# Altium project Explorer STM32F4_V2.2.PrjPcb
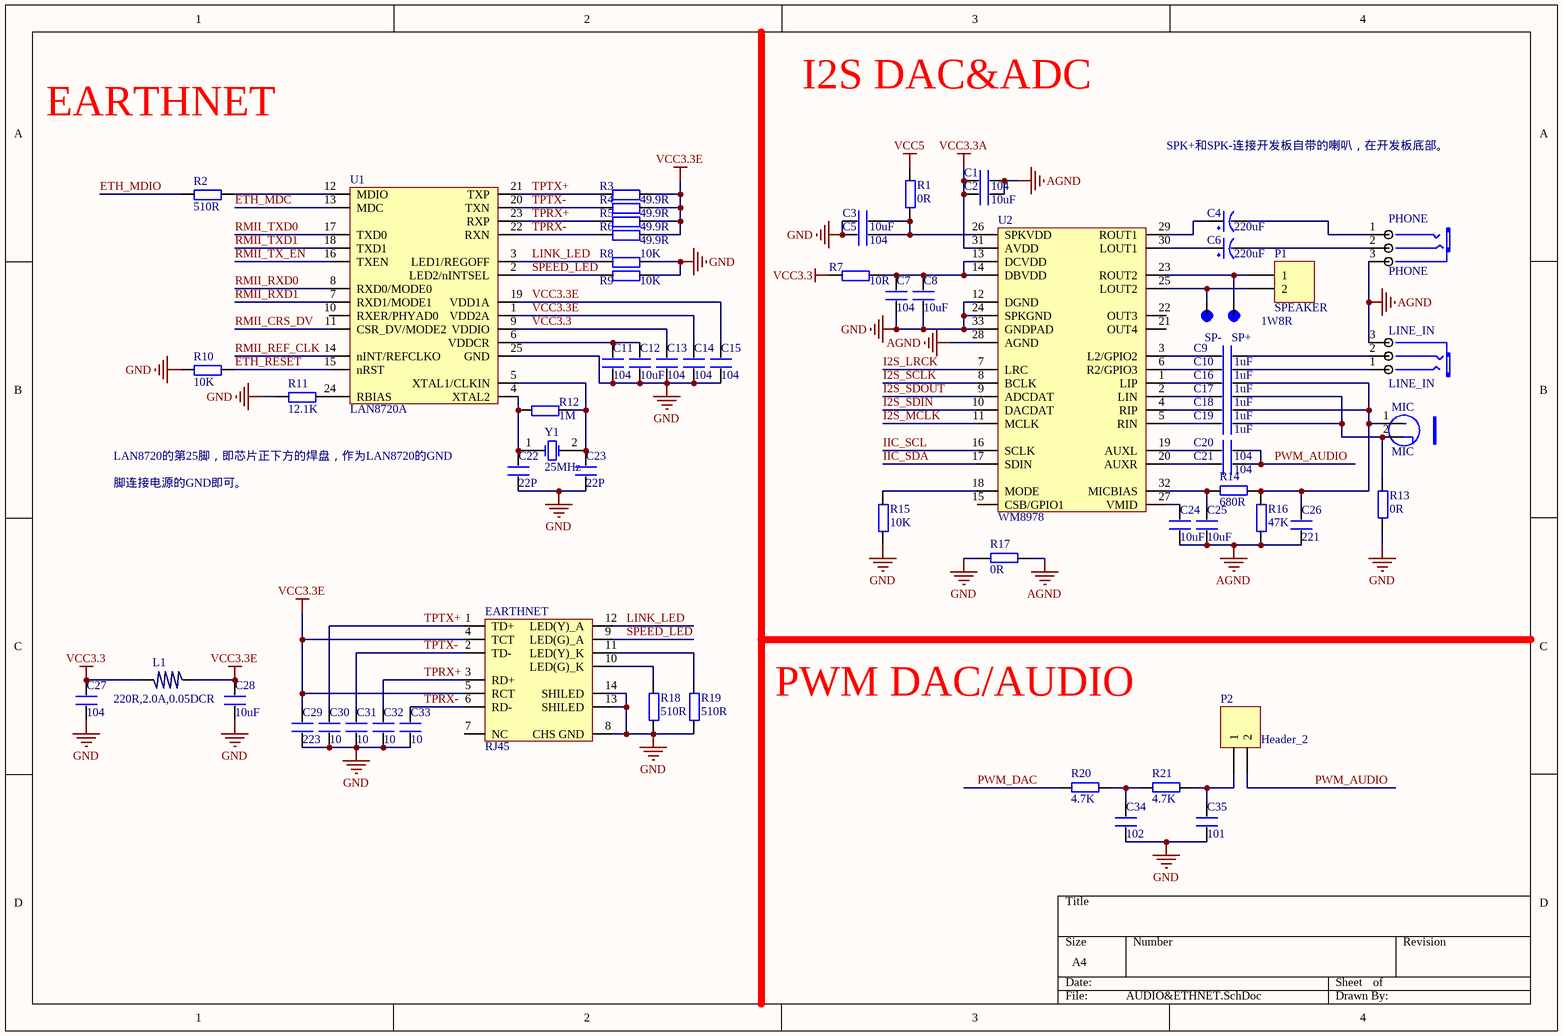
[diagram p0: AUDIO&ETHNET.SchDoc]
4 sheets, 259 parts. Net scope: global (net labels, ports and power ports of the same name join across sheets).
Board file: STM32F4_V2.2.PcbDoc
Sheets:
  AUDIO&ETHNET.SchDoc
  CORE.SchDoc
  DEVICES.SchDoc
  POWER&USB_USART.SchDoc

## Sheet AUDIO&ETHNET.SchDoc
size A4

### Parts
C1  104  [R0603]
C2  10uF  [1206]
C3  10uF  [1206]
C4  220uF  [CC6.56.5]
C5  104  [R0603]
C6  220uF  [CC6.56.5]
C7  104  [R0603]
C8  10uF  [1206]
C9  1uF  [R0603]
C10  1uF  [R0603]
C11  104  [R0603]
C12  10uF  [1206]
C13  104  [R0603]
C14  104  [R0603]
C15  104  [R0603]
C16  1uF  [R0603]
C17  1uF  [R0603]
C18  1uF  [R0603]
C19  1uF  [R0603]
C20  104  [R0603]
C21  104  [R0603]
C22  22P  [R0603]
C23  22P  [R0603]
C24  10uF  [1206]
C25  10uF  [1206]
C26  221  [R0603]
C27  104  [R0603]
C28  10uF  [1206]
C29  223  [R0603]
C30  10  [R0603]
C31  10  [R0603]
C32  10  [R0603]
C33  10  [R0603]
C34  102  [R0603]
C35  101  [R0603]
EARTHNET  RJ45  [HR911105A]
L1  220R,2.0A,0.05DCR  [R0603]
LINE_IN  LINE_IN  [PHONE_ST]
MIC  MIC  [MIC6027]
P1  SPEAKER  [HDR1X2]
P2  Header_2  [HDR1X2]
PHONE  PHONE  [PHONE_ST]
R1  0R  [R0603]
R2  510R  [R0603]
R3  49.9R  [R0603]
R4  49.9R  [R0603]
R5  49.9R  [R0603]
R6  49.9R  [R0603]
R7  10R  [R0603]
R8  10K  [R0603]
R9  10K  [R0603]
R10  10K  [R0603]
R11  12.1K  [R0603]
R12  1M  [R0603]
R13  0R  [R0603]
R14  680R  [R0603]
R15  10K  [R0603]
R16  47K  [R0603]
R17  0R  [R0603]
R18  510R  [R0603]
R19  510R  [R0603]
R20  4.7K  [R0603]
R21  4.7K  [R0603]
SP+  TEST_POINT  [TEST_POINT]  (value not drawn)
SP-  TEST_POINT  [TEST_POINT]  (value not drawn)
U1  LAN8720A  [QFN24_NEW]
U2  WM8978  [qfn32]
Y1  25MHz  [XTAL_US]

### Nets
AGND: C1.1 C2.1 C24.2 C25.2 C26.2 LINE_IN.3(COM) PHONE.3(COM) R16.1 R17.1 U2.28(AGND)
GND: C3.2 C5.2 C7.2 C8.2 C11.1 C12.1 C13.1 C14.1 C15.1 C22.1 C23.1 C27.1 C28.1 C29.1 C30.1 C31.1 C32.1 C33.1 C34.1 C35.1 EARTHNET.8(CHS_GND) EARTHNET.13(SHILED) EARTHNET.14(SHILED) R8.2 R9.2 R10.1 R11.1 R13.1 R15.1 R17.2 R18.1 R19.1 U1.25(GND) U2.12(DGND) U2.24(SPKGND) U2.33(GNDPAD)
VCC3.3: C13.2 C27.2 L1.2 R7.1 U1.9(VDDIO)
VCC3.3A: C1.2 C2.2 U2.31(AVDD)
VCC3.3E: C14.2 C15.2 C28.2 C29.2 EARTHNET.4(TCT) EARTHNET.5(RCT) L1.1 R3.2 R4.2 R5.2 R6.2 U1.1(VDD2A) U1.19(VDD1A)
VCC5: R1.2
ETH_MDC: U1.13(MDC)
ETH_MDIO: R2.1
ETH_RESET: R10.2 U1.15(nRST)
I2S_LRCK: U2.7(LRC)
I2S_MCLK: U2.11(MCLK)  [project net DCMI_D0]
I2S_SCLK: U2.8(BCLK)
I2S_SDIN: U2.10(DACDAT)
I2S_SDOUT: U2.9(ADCDAT)
IIC_SCL: U2.16(SCLK)
IIC_SDA: U2.17(SDIN)
LINK_LED: EARTHNET.12(LED(Y)_A) R8.1 U1.3(LED1/REGOFF)
PWM_AUDIO: C20.2 C21.2 P2.2
PWM_DAC: R20.2  [project net PA3]
RMII_CRS_DV: U1.11(CSR_DV/MODE2)  [project net PA7]
RMII_REF_CLK: U1.14(nINT/REFCLKO)  [project net PA1]
RMII_RXD0: U1.8(RXD0/MODE0)  [project net PC4]
RMII_RXD1: U1.7(RXD1/MODE1)  [project net PC5]
RMII_TX_EN: U1.16(TXEN)  [project net PG11]
RMII_TXD0: U1.17(TXD0)  [project net PG13]
RMII_TXD1: U1.18(TXD1)  [project net PG14]
SPEED_LED: EARTHNET.9(LED(G)_A) R9.1 U1.2(LED2/nINTSEL)
TPRX+: C32.2 EARTHNET.3(RD+) R5.1 U1.23(RXP)
TPRX-: C33.2 EARTHNET.6(RD-) R6.1 U1.22(RXN)
TPTX+: C30.2 EARTHNET.1(TD+) R3.1 U1.21(TXP)
TPTX-: C31.2 EARTHNET.2(TD-) R4.1 U1.20(TXN)
NetC3_1: C3.1 C5.1 R1.1 U2.26(SPKVDD)
NetC4_1: C4.1(VCC) U2.29(ROUT1)
NetC4_2: C4.2(GND) PHONE.1(CHL)
NetC6_1: C6.1(VCC) U2.30(LOUT1)
NetC6_2: C6.2(GND) PHONE.2(CHR)
NetC7_1: C7.1 C8.1 R7.2 U2.13(DCVDD) U2.14(DBVDD)
NetC9_1: C9.1 U2.3(L2/GPIO2)
NetC9_2: C9.2 LINE_IN.2(CHR)
NetC10_1: C10.1 U2.6(R2/GPIO3)
NetC10_2: C10.2 LINE_IN.1(CHL)
NetC11_2: C11.2 C12.2 U1.6(VDDCR)
NetC16_1: C16.1 U2.1(LIP)
NetC16_2: C16.2 C18.2 C26.1 MIC.1(VCC) R14.1 R16.2
NetC17_1: C17.1 U2.2(LIN)
NetC17_2: C17.2 C19.2 MIC.2(GND) R13.2
NetC18_1: C18.1 U2.4(RIP)
NetC19_1: C19.1 U2.5(RIN)
NetC20_1: C20.1 U2.19(AUXL)
NetC21_1: C21.1 U2.20(AUXR)
NetC22_2: C22.2 R12.1 U1.4(XTAL2) Y1.1(OSC1)
NetC23_2: C23.2 R12.2 U1.5(XTAL1/CLKIN) Y1.2(OSC2)
NetC24_1: C24.1 U2.27(VMID)
NetC25_1: C25.1 R14.2 U2.32(MICBIAS)
NetC34_2: C34.2 R20.1 R21.2
NetC35_2: C35.2 P2.1 R21.1
NetEARTHNET_10: EARTHNET.10(LED(G)_K) R18.2
NetEARTHNET_11: EARTHNET.11(LED(Y)_K) R19.2
NetP1_1: P1.1 SP+.1 U2.23(ROUT2)
NetP1_2: P1.2 SP-.1 U2.25(LOUT2)
NetR2_2: R2.2 U1.12(MDIO)
NetR11_2: R11.2 U1.24(RBIAS)
NetR15_2: R15.2 U2.18(MODE)

Not connected (* = marked no-connect by the designer): EARTHNET 7(NC); U1 10(RXER/PHYAD0); U2 15(CSB/GPIO1) 21(OUT4) 22(OUT3)

### Notes on the sheet
- I2S DAC&ADC
- EARTHNET
- SPK+和SPK-连接开发板自带的喇叭，在开发板底部。
- 1W8R
- LAN8720的第25脚，即芯片正下方的焊盘，作为LAN8720的GND
- 脚连接电源的GND即可。
- PWM DAC/AUDIO

### Library data of the parts
C1-C3 C5 C7-C35 = C
C4 C6 = CAP
EARTHNET = HR911105
L1 = L
LINE_IN PHONE = PHONE_M
P1 P2 = Header 2: Header, 2-Pin; LatestRevisionDate: 17-Jul-2002; LatestRevisionNote: Re-released for DXP Platform.; Publisher: Altium Limited
R1-R21 = R
U1 = LAN8720: ETH PHY
U2 = WM8978: 24bit ADC&DAC
Y1 = XTAL: Crystal Oscillator; Published: 8-Jun-2000; LatestRevisionDate: 17-Jul-2002; LatestRevisionNote: Re-released for DXP Platform.; Publisher: Altium Limited

## Sheet CORE.SchDoc
size A3
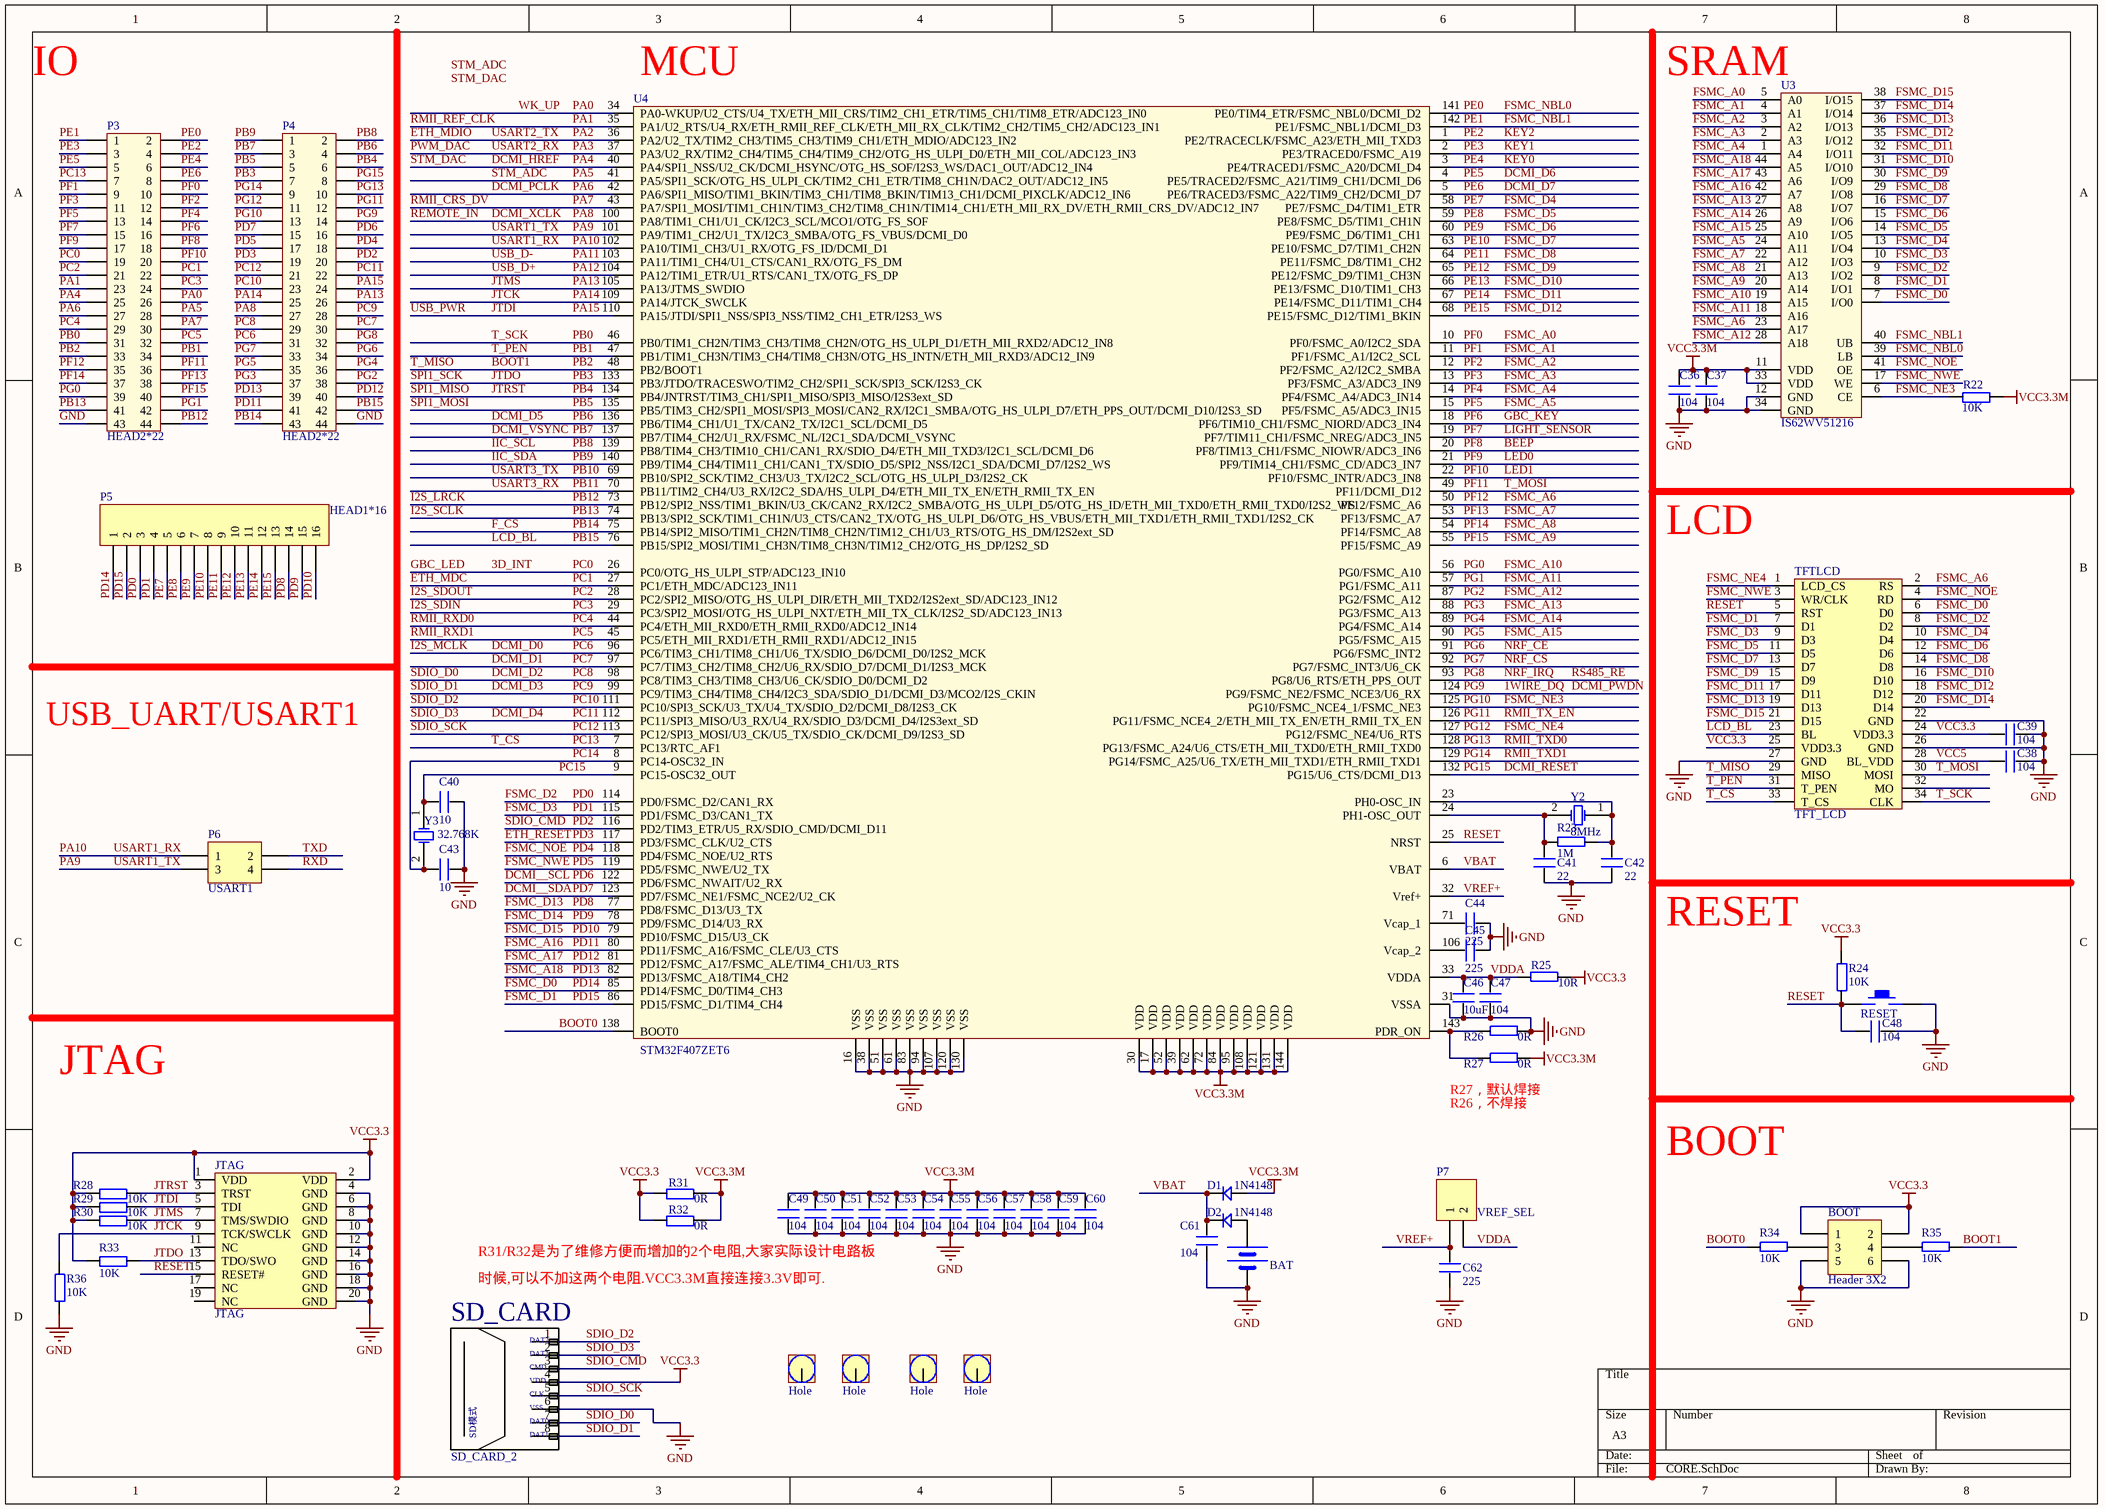
[diagram p1: CORE.SchDoc]

### Parts
BAT  BATT  [BATM]  (value not drawn)
BOOT  Header 3X2  [HDR2X3]
C36  104  [R0603]
C37  104  [R0603]
C38  104  [R0603]
C39  104  [R0603]
C40  10  [R0603]
C41  22  [R0603]
C42  22  [R0603]
C43  10  [R0603]
C44  225  [R0603]
C45  225  [R0603]
C46  10uF  [1206]
C47  104  [R0603]
C48  104  [R0603]
C49  104  [R0603]
C50  104  [R0603]
C51  104  [R0603]
C52  104  [R0603]
C53  104  [R0603]
C54  104  [R0603]
C55  104  [R0603]
C56  104  [R0603]
C57  104  [R0603]
C58  104  [R0603]
C59  104  [R0603]
C60  104  [R0603]
C61  104  [R0603]
C62  225  [R0603]
D1  1N4148  [DIODE_SOP]
D2  1N4148  [DIODE_SOP]
H1  Hole  [Hole_4.3Y]
H2  Hole  [Hole_4.3Y]
H3  Hole  [Hole_4.3Y]
H4  Hole  [Hole_4.3Y]
JTAG  JTAG  [JTAG_20]
P3  HEAD2*22  [HEAD2*22]
P4  HEAD2*22  [HEAD2*22]
P5  HEAD1*16  [HDR1X16]
P6  USART1  [HDR2X2]
P7  VREF_SEL  [HDR1X2]
R22  10K  [R0603]
R23  1M  [R0603]
R24  10K  [R0603]
R25  10R  [R0603]
R26  0R  [R0603]
R27  0R  [R0603]
R28  10K  [R0603]
R29  10K  [R0603]
R30  10K  [R0603]
R31  0R  [R0603]
R32  0R  [R0603]
R33  10K  [R0603]
R34  10K  [R0603]
R35  10K  [R0603]
R36  10K  [R0603]
RESET  KEY_M  [KEY_M]  (value not drawn)
SD_CARD_2  存储器接口  [TF_CARD_2]  (value not drawn)
TFTLCD  TFT_LCD  [db2*17-4.3]
U3  IS62WV51216  [TSOP44]
U4  STM32F407ZET6  [LQFP144]
Y2  8MHz  [XTAL_US]
Y3  32.768K  [XTAL32]

### Nets
GND: BAT.2(GND) BOOT.5 BOOT.6 C36.2 C37.2 C38.2 C39.2 C40.1 C41.2 C42.2 C43.1 C44.2 C45.2 C46.1 C47.1 C48.1 C49.1 C50.1 C51.1 C52.1 C53.1 C54.1 C55.1 C56.1 C57.1 C58.1 C59.1 C60.1 C61.2 C62.2 JTAG.4(GND) JTAG.6(GND) JTAG.8(GND) JTAG.10(GND) JTAG.12(GND) JTAG.14(GND) JTAG.16(GND) JTAG.18(GND) JTAG.20(GND) P3.43 P4.21 P4.44 R26.1 R36.1 RESET.2 SD_CARD_2.5(CLK) SD_CARD_2.6(VSS) TFTLCD.22(GND) TFTLCD.26(GND) TFTLCD.27(GND) U3.12(GND) U3.34(GND) U4.16(VSS) U4.31(VSSA) U4.38(VSS) U4.51(VSS) U4.61(VSS) U4.83(VSS) U4.94(VSS) U4.107(VSS) U4.113(PC12/SPI3_MOSI/U3_CK/U5_TX/SDIO_CK/DCMI_D9/I2S3_SD) U4.120(VSS) U4.130(VSS)  [also labelled PC12, SDIO_SCK]
VCC3.3: BOOT.1 BOOT.2 C39.1 JTAG.1(VDD) JTAG.2(VDD) R24.2 R25.1 R28.1 R29.1 R30.1 R31.1 R32.1 R33.1 SD_CARD_2.4(VDD) TFTLCD.24(VDD3.3) TFTLCD.25(VDD3.3)
VCC3.3M: C36.1 C37.1 C49.2 C50.2 C51.2 C52.2 C53.2 C54.2 C55.2 C56.2 C57.2 C58.2 C59.2 C60.2 D1.1 R22.2 R27.1 R31.2 R32.2 U3.11(VDD) U3.33(VDD) U4.17(VDD) U4.30(VDD) U4.39(VDD) U4.52(VDD) U4.62(VDD) U4.72(VDD) U4.84(VDD) U4.95(VDD) U4.108(VDD) U4.121(VDD) U4.131(VDD) U4.144(VDD)
VCC5: C38.1 TFTLCD.28(BL_VDD)
1WIRE_DQ: P4.14 U4.124(PG9/FSMC_NE2/FSMC_NCE3/U6_RX)  [also labelled DCMI_PWDN, PG9]
3D_INT: P3.19 U4.26(PC0/OTG_HS_ULPI_STP/ADC123_IN10)  [also labelled GBC_LED, PC0]
BEEP: P3.18 U4.20(PF8/TIM13_CH1/FSMC_NIOWR/ADC3_IN6)  [also labelled PF8]
BOOT0: R34.2 U4.138(BOOT0)
BOOT1: P3.33 R35.1 TFTLCD.29(MISO) U4.48(PB2/BOOT1)  [also labelled PB2, T_MISO]
DCMI__SCL: P4.16 U4.122(PD6/FSMC_NWAIT/U2_RX)  [also labelled PD6]
DCMI__SDA: P4.15 U4.123(PD7/FSMC_NE1/FSMC_NCE2/U2_CK)  [also labelled PD7]
DCMI_D0: P4.31 U4.96(PC6/TIM3_CH1/TIM8_CH1/U6_TX/SDIO_D6/DCMI_D0/I2S2_MCK)  [also labelled I2S_MCLK, PC6]
DCMI_D1: P4.30 U4.97(PC7/TIM3_CH2/TIM8_CH2/U6_RX/SDIO_D7/DCMI_D1/I2S3_MCK)  [also labelled PC7]
DCMI_D2: P4.29 SD_CARD_2.7(DAT0/DO) U4.98(PC8/TIM3_CH3/TIM8_CH3/U6_CK/SDIO_D0/DCMI_D2)  [also labelled PC8, SDIO_D0]
DCMI_D3: P4.28 SD_CARD_2.8(DAT1/X) U4.99(PC9/TIM3_CH4/TIM8_CH4/I2C3_SDA/SDIO_D1/DCMI_D3/MCO2/I2S_CKIN)  [also labelled PC9, SDIO_D1]
DCMI_D4: P4.22 SD_CARD_2.2(CD/DAT3/CS) U4.112(PC11/SPI3_MISO/U3_RX/U4_RX/SDIO_D3/DCMI_D4/I2S3ext_SD)  [also labelled PC11, SDIO_D3]
DCMI_D5: P4.4 U4.136(PB6/TIM4_CH1/U1_TX/CAN2_TX/I2C1_SCL/DCMI_D5)  [also labelled PB6]
DCMI_D6: P3.5 U4.4(PE5/TRACED2/FSMC_A21/TIM9_CH1/DCMI_D6)  [also labelled PE5]
DCMI_D7: P3.8 U4.5(PE6/TRACED3/FSMC_A22/TIM9_CH2/DCMI_D7)  [also labelled PE6]
DCMI_HREF: P3.25 U4.40(PA4/SPI1_NSS/U2_CK/DCMI_HSYNC/OTG_HS_SOF/I2S3_WS/DAC1_OUT/ADC12_IN4)  [also labelled PA4, STM_DAC]
DCMI_PCLK: P3.27 U4.42(PA6/SPI1_MISO/TIM1_BKIN/TIM3_CH1/TIM8_BKIN/TIM13_CH1/DCMI_PIXCLK/ADC12_IN6)  [also labelled PA6]
DCMI_RESET: P4.8 U4.132(PG15/U6_CTS/DCMI_D13)  [also labelled PG15]
DCMI_VSYNC: P4.3 U4.137(PB7/TIM4_CH2/U1_RX/FSMC_NL/I2C1_SDA/DCMI_VSYNC)  [also labelled PB7]
DCMI_XCLK: P4.27 U4.100(PA8/TIM1_CH1/U1_CK/I2C3_SCL/MCO1/OTG_FS_SOF)  [also labelled PA8, REMOTE_IN]
ETH_MDC: P3.22 U4.27(PC1/ETH_MDC/ADC123_IN11)  [also labelled PC1]
ETH_MDIO: U4.36(PA2/U2_TX/TIM2_CH3/TIM5_CH3/TIM9_CH1/ETH_MDIO/ADC123_IN2)  [also labelled PA2, USART2_TX]
ETH_RESET: P4.19 U4.117(PD3/FSMC_CLK/U2_CTS)  [also labelled PD3]
F_CS: P4.43 U4.75(PB14/SPI2_MISO/TIM1_CH2N/TIM8_CH2N/TIM12_CH1/U3_RTS/OTG_HS_DM/I2S2ext_SD)  [also labelled PB14]
FSMC_A0: P3.10 U3.5(A0) U4.10(PF0/FSMC_A0/I2C2_SDA)  [also labelled PF0]
FSMC_A1: P3.9 U3.4(A1) U4.11(PF1/FSMC_A1/I2C2_SCL)  [also labelled PF1]
FSMC_A2: P3.12 U3.3(A2) U4.12(PF2/FSMC_A2/I2C2_SMBA)  [also labelled PF2]
FSMC_A3: P3.11 U3.2(A3) U4.13(PF3/FSMC_A3/ADC3_IN9)  [also labelled PF3]
FSMC_A4: P3.14 U3.1(A4) U4.14(PF4/FSMC_A4/ADC3_IN14)  [also labelled PF4]
FSMC_A5: P3.13 U3.24(A11) U4.15(PF5/FSMC_A5/ADC3_IN15)  [also labelled PF5]
FSMC_A6: P3.35 TFTLCD.2(RS) U3.23(A17) U4.50(PF12/FSMC_A6)  [also labelled PF12]
FSMC_A7: P3.38 U3.22(A12) U4.53(PF13/FSMC_A7)  [also labelled PF13]
FSMC_A8: P3.37 U3.21(A13) U4.54(PF14/FSMC_A8)  [also labelled PF14]
FSMC_A9: P3.40 U3.20(A14) U4.55(PF15/FSMC_A9)  [also labelled PF15]
FSMC_A10: P3.39 U3.19(A15) U4.56(PG0/FSMC_A10)  [also labelled PG0]
FSMC_A11: P3.42 U3.18(A16) U4.57(PG1/FSMC_A11)  [also labelled PG1]
FSMC_A12: P4.38 U3.28(A18) U4.87(PG2/FSMC_A12)  [also labelled PG2]
FSMC_A13: P4.37 U3.27(A8) U4.88(PG3/FSMC_A13)  [also labelled PG3]
FSMC_A14: P4.36 U3.26(A9) U4.89(PG4/FSMC_A14)  [also labelled PG4]
FSMC_A15: P4.35 U3.25(A10) U4.90(PG5/FSMC_A15)  [also labelled PG5]
FSMC_A16: P4.41 U3.42(A7) U4.80(PD11/FSMC_A16/FSMC_CLE/U3_CTS)  [also labelled PD11]
FSMC_A17: P4.40 U3.43(A6) U4.81(PD12/FSMC_A17/FSMC_ALE/TIM4_CH1/U3_RTS)  [also labelled PD12]
FSMC_A18: P4.39 U3.44(A5) U4.82(PD13/FSMC_A18/TIM4_CH2)  [also labelled PD13]
FSMC_D0: P5.1 TFTLCD.6(D0) U3.7(I/O0) U4.85(PD14/FSMC_D0/TIM4_CH3)  [also labelled PD14]
FSMC_D1: P5.2 TFTLCD.7(D1) U3.8(I/O1) U4.86(PD15/FSMC_D1/TIM4_CH4)  [also labelled PD15]
FSMC_D2: P5.3 TFTLCD.8(D2) U3.9(I/O2) U4.114(PD0/FSMC_D2/CAN1_RX)  [also labelled PD0]
FSMC_D3: P5.4 TFTLCD.9(D3) U3.10(I/O3) U4.115(PD1/FSMC_D3/CAN1_TX)  [also labelled PD1]
FSMC_D4: P5.5 TFTLCD.10(D4) U3.13(I/O4) U4.58(PE7/FSMC_D4/TIM1_ETR)  [also labelled PE7]
FSMC_D5: P5.6 TFTLCD.11(D5) U3.14(I/O5) U4.59(PE8/FSMC_D5/TIM1_CH1N)  [also labelled PE8]
FSMC_D6: P5.7 TFTLCD.12(D6) U3.15(I/O6) U4.60(PE9/FSMC_D6/TIM1_CH1)  [also labelled PE9]
FSMC_D7: P5.8 TFTLCD.13(D7) U3.16(I/O7) U4.63(PE10/FSMC_D7/TIM1_CH2N)  [also labelled PE10]
FSMC_D8: P5.9 TFTLCD.14(D8) U3.29(I/O8) U4.64(PE11/FSMC_D8/TIM1_CH2)  [also labelled PE11]
FSMC_D9: P5.10 TFTLCD.15(D9) U3.30(I/O9) U4.65(PE12/FSMC_D9/TIM1_CH3N)  [also labelled PE12]
FSMC_D10: P5.11 TFTLCD.16(D10) U3.31(I/O10) U4.66(PE13/FSMC_D10/TIM1_CH3)  [also labelled PE13]
FSMC_D11: P5.12 TFTLCD.17(D11) U3.32(I/O11) U4.67(PE14/FSMC_D11/TIM1_CH4)  [also labelled PE14]
FSMC_D12: P5.13 TFTLCD.18(D12) U3.35(I/O12) U4.68(PE15/FSMC_D12/TIM1_BKIN)  [also labelled PE15]
FSMC_D13: P5.14 TFTLCD.19(D13) U3.36(I/O13) U4.77(PD8/FSMC_D13/U3_TX)  [also labelled PD8]
FSMC_D14: P5.15 TFTLCD.20(D14) U3.37(I/O14) U4.78(PD9/FSMC_D14/U3_RX)  [also labelled PD9]
FSMC_D15: P5.16 TFTLCD.21(D15) U3.38(I/O15) U4.79(PD10/FSMC_D15/U3_CK)  [also labelled PD10]
FSMC_NBL0: P3.2 U3.39(LB) U4.141(PE0/TIM4_ETR/FSMC_NBL0/DCMI_D2)  [also labelled PE0]
FSMC_NBL1: P3.1 U3.40(UB) U4.142(PE1/FSMC_NBL1/DCMI_D3)  [also labelled PE1]
FSMC_NE3: P4.13 R22.1 U3.6(CE) U4.125(PG10/FSMC_NCE4_1/FSMC_NE3)  [also labelled PG10]
FSMC_NE4: P4.11 TFTLCD.1(LCD_CS) U4.127(PG12/FSMC_NE4/U6_RTS)  [also labelled PG12]
FSMC_NOE: P4.18 TFTLCD.4(RD) U3.41(OE) U4.118(PD4/FSMC_NOE/U2_RTS)  [also labelled PD4]
FSMC_NWE: P4.17 TFTLCD.3(WR/CLK) U3.17(WE) U4.119(PD5/FSMC_NWE/U2_TX)  [also labelled PD5]
GBC_KEY: P3.16 U4.18(PF6/TIM10_CH1/FSMC_NIORD/ADC3_IN4)  [also labelled PF6]
I2S_LRCK: P3.44 U4.73(PB12/SPI2_NSS/TIM1_BKIN/U3_CK/CAN2_RX/I2C2_SMBA/OTG_HS_ULPI_D5/OTG_HS_ID/ETH_MII_TXD0/ETH_RMII_TXD0/I2S2_WS)  [also labelled PB12]
I2S_SCLK: P3.41 U4.74(PB13/SPI2_SCK/TIM1_CH1N/U3_CTS/CAN2_TX/OTG_HS_ULPI_D6/OTG_HS_VBUS/ETH_MII_TXD1/ETH_RMII_TXD1/I2S2_CK)  [also labelled PB13]
I2S_SDIN: P3.24 U4.29(PC3/SPI2_MOSI/OTG_HS_ULPI_NXT/ETH_MII_TX_CLK/I2S2_SD/ADC123_IN13)  [also labelled PC3]
I2S_SDOUT: P3.21 U4.28(PC2/SPI2_MISO/OTG_HS_ULPI_DIR/ETH_MII_TXD2/I2S2ext_SD/ADC123_IN12)  [also labelled PC2]
IIC_SCL: P4.2 U4.139(PB8/TIM4_CH3/TIM10_CH1/CAN1_RX/SDIO_D4/ETH_MII_TXD3/I2C1_SCL/DCMI_D6)  [also labelled PB8]
IIC_SDA: P4.1 U4.140(PB9/TIM4_CH4/TIM11_CH1/CAN1_TX/SDIO_D5/SPI2_NSS/I2C1_SDA/DCMI_D7/I2S2_WS)  [also labelled PB9]
JTCK: JTAG.9(TCK/SWCLK) P4.25 R36.2 U4.109(PA14/JTCK_SWCLK)  [also labelled PA14]
JTDI: JTAG.5(TDI) P4.24 R29.2 U4.110(PA15/JTDI/SPI1_NSS/SPI3_NSS/TIM2_CH1_ETR/I2S3_WS)  [also labelled PA15, USB_PWR]
JTDO: JTAG.13(TDO/SWO) P4.7 R33.2 U4.133(PB3/JTDO/TRACESWO/TIM2_CH2/SPI1_SCK/SPI3_SCK/I2S3_CK)  [also labelled PB3, SPI1_SCK]
JTMS: JTAG.7(TMS/SWDIO) P4.26 R30.2 U4.105(PA13/JTMS_SWDIO)  [also labelled PA13]
JTRST: JTAG.3(TRST) P4.6 R28.2 U4.134(PB4/JNTRST/TIM3_CH1/SPI1_MISO/SPI3_MISO/I2S3ext_SD)  [also labelled PB4, SPI1_MISO]
KEY0: P3.6 U4.3(PE4/TRACED1/FSMC_A20/DCMI_D4)  [also labelled PE4]
KEY1: P3.3 U4.2(PE3/TRACED0/FSMC_A19)  [also labelled PE3]
KEY2: P3.4 U4.1(PE2/TRACECLK/FSMC_A23/ETH_MII_TXD3)  [also labelled PE2]
LCD_BL: P4.42 TFTLCD.23(BL) U4.76(PB15/SPI2_MOSI/TIM1_CH3N/TIM8_CH3N/TIM12_CH2/OTG_HS_DP/I2S2_SD)  [also labelled PB15]
LED0: P3.17 U4.21(PF9/TIM14_CH1/FSMC_CD/ADC3_IN7)  [also labelled PF9]
LED1: P3.20 U4.22(PF10/FSMC_INTR/ADC3_IN8)  [also labelled PF10]
LIGHT_SENSOR: P3.15 U4.19(PF7/TIM11_CH1/FSMC_NREG/ADC3_IN5)  [also labelled PF7]
NRF_CE: P4.34 U4.91(PG6/FSMC_INT2)  [also labelled PG6]
NRF_CS: P4.33 U4.92(PG7/FSMC_INT3/U6_CK)  [also labelled PG7]
NRF_IRQ: P4.32 U4.93(PG8/U6_RTS/ETH_PPS_OUT)  [also labelled PG8, RS485_RE]
PA0: P3.26 U4.34(PA0-WKUP/U2_CTS/U4_TX/ETH_MII_CRS/TIM2_CH1_ETR/TIM5_CH1/TIM8_ETR/ADC123_IN0)  [also labelled WK_UP]
PA1: P3.23 U4.35(PA1/U2_RTS/U4_RX/ETH_RMII_REF_CLK/ETH_MII_RX_CLK/TIM2_CH2/TIM5_CH2/ADC123_IN1)  [also labelled RMII_REF_CLK]
PA3: U4.37(PA3/U2_RX/TIM2_CH4/TIM5_CH4/TIM9_CH2/OTG_HS_ULPI_D0/ETH_MII_COL/ADC123_IN3)  [also labelled PWM_DAC, USART2_RX]
PA5: P3.28 U4.41(PA5/SPI1_SCK/OTG_HS_ULPI_CK/TIM2_CH1_ETR/TIM8_CH1N/DAC2_OUT/ADC12_IN5)  [also labelled STM_ADC]
PA7: P3.30 U4.43(PA7/SPI1_MOSI/TIM1_CH1N/TIM3_CH2/TIM8_CH1N/TIM14_CH1/ETH_MII_RX_DV/ETH_RMII_CRS_DV/ADC12_IN7)  [also labelled RMII_CRS_DV]
PA9: P6.3 U4.101(PA9/TIM1_CH2/U1_TX/I2C3_SMBA/OTG_FS_VBUS/DCMI_D0)  [also labelled USART1_TX]
PA10: P6.1 U4.102(PA10/TIM1_CH3/U1_RX/OTG_FS_ID/DCMI_D1)  [also labelled USART1_RX]
PA11: U4.103(PA11/TIM1_CH4/U1_CTS/CAN1_RX/OTG_FS_DM)  [also labelled USB_D-]
PA12: U4.104(PA12/TIM1_ETR/U1_RTS/CAN1_TX/OTG_FS_DP)  [also labelled USB_D+]
PB0: P3.31 TFTLCD.34(CLK) U4.46(PB0/TIM1_CH2N/TIM3_CH3/TIM8_CH2N/OTG_HS_ULPI_D1/ETH_MII_RXD2/ADC12_IN8)  [also labelled T_SCK]
PB1: P3.34 TFTLCD.31(T_PEN) U4.47(PB1/TIM1_CH3N/TIM3_CH4/TIM8_CH3N/OTG_HS_INTN/ETH_MII_RXD3/ADC12_IN9)  [also labelled T_PEN]
PB5: P4.5 U4.135(PB5/TIM3_CH2/SPI1_MOSI/SPI3_MOSI/CAN2_RX/I2C1_SMBA/OTG_HS_ULPI_D7/ETH_PPS_OUT/DCMI_D10/I2S3_SD)  [also labelled SPI1_MOSI]
PB10: U4.69(PB10/SPI2_SCK/TIM2_CH3/U3_TX/I2C2_SCL/OTG_HS_ULPI_D3/I2S2_CK)  [also labelled USART3_TX]
PB11: U4.70(PB11/TIM2_CH4/U3_RX/I2C2_SDA/HS_ULPI_D4/ETH_MII_TX_EN/ETH_RMII_TX_EN)  [also labelled USART3_RX]
PC4: P3.29 U4.44(PC4/ETH_MII_RXD0/ETH_RMII_RXD0/ADC12_IN14)  [also labelled RMII_RXD0]
PC5: P3.32 U4.45(PC5/ETH_MII_RXD1/ETH_RMII_RXD1/ADC12_IN15)  [also labelled RMII_RXD1]
PC10: P4.23 SD_CARD_2.1(DTA2/X) U4.111(PC10/SPI3_SCK/U3_TX/U4_TX/SDIO_D2/DCMI_D8/I2S3_CK)  [also labelled SDIO_D2]
PC13: P3.7 TFTLCD.33(T_CS) U4.7(PC13/RTC_AF1)  [also labelled T_CS]
PC14: C43.2 U4.8(PC14-OSC32_IN) Y3.2(OSC2)
PC15: C40.2 U4.9(PC15-OSC32_OUT) Y3.1(OSC1)
PD2: P4.20 SD_CARD_2.3(CMD/DI) U4.116(PD2/TIM3_ETR/U5_RX/SDIO_CMD/DCMI_D11)  [also labelled SDIO_CMD]
PF11: P3.36 TFTLCD.30(MOSI) U4.49(PF11/DCMI_D12)  [also labelled T_MOSI]
PG11: P4.12 U4.126(PG11/FSMC_NCE4_2/ETH_MII_TX_EN/ETH_RMII_TX_EN)  [also labelled RMII_TX_EN]
PG13: P4.10 U4.128(PG13/FSMC_A24/U6_CTS/ETH_MII_TXD0/ETH_RMII_TXD0)  [also labelled RMII_TXD0]
PG14: P4.9 U4.129(PG14/FSMC_A25/U6_TX/ETH_MII_TXD1/ETH_RMII_TXD1)  [also labelled RMII_TXD1]
RESET: C48.2 JTAG.15(RESET#) R24.1 RESET.1 TFTLCD.5(RST) U4.25(NRST)
RXD: P6.4
TXD: P6.2
VBAT: C61.1 D1.2 D2.2 U4.6(VBAT)
VDDA: C46.2 C47.2 P7.2 R25.2 U4.33(VDDA)
VREF+: C62.1 P7.1 U4.32(Vref+)
NetBAT_1: BAT.1(VCC) D2.1
NetBOOT_3: BOOT.3 R34.1
NetBOOT_4: BOOT.4 R35.2
NetC41_1: C41.1 R23.2 U4.24(PH1-OSC_OUT) Y2.2(OSC2)
NetC42_1: C42.1 R23.1 U4.23(PH0-OSC_IN) Y2.1(OSC1)
NetC44_1: C44.1 U4.71(Vcap_1)
NetC45_1: C45.1 U4.106(Vcap_2)
NetR26_2: R26.2 R27.2 U4.143(PDR_ON)

Not connected (* = marked no-connect by the designer): H1 1; H2 1; H3 1; H4 1; JTAG 11(NC) 17(NC) 19(NC); TFTLCD 32(MO)

### Notes on the sheet
- IO
- (near U4) MCU
- (near U3) SRAM
- LCD
- USB_UART/USART1
- RESET
- JTAG
- (near R27) R27，默认焊接
- R26，不焊接
- BOOT
- (near R32) R31/R32是为了维修方便而增加的2个电阻,大家实际设计电路板
- (near SD_CARD_2) SD_CARD
- 时候,可以不加这两个电阻.VCC3.3M直接连接3.3V即可.
- Labels drawn without touching a wire or pin: STM_ADC, STM_DAC
- (in symbol TF) DAT2; DAT3; CMD; SD模式; DAT0; DAT1

### Library data of the parts
BAT = BAT
BOOT = Header 3X2: Header, 3-Pin, Dual row; LatestRevisionDate: 17-Jul-2002; LatestRevisionNote: Re-released for DXP Platform.; Publisher: Altium Limited
C36-C62 = C
D1 D2 = D
P5 = Header 16: Header, 16-Pin; LatestRevisionDate: 17-Jul-2002; LatestRevisionNote: Re-released for DXP Platform.; Publisher: Altium Limited
P6 = Header 2X2: Header, 2-Pin, Dual row; LatestRevisionDate: 17-Jul-2002; LatestRevisionNote: Re-released for DXP Platform.; Publisher: Altium Limited
P7 = Header 2: Header, 2-Pin; LatestRevisionDate: 17-Jul-2002; LatestRevisionNote: Re-released for DXP Platform.; Publisher: Altium Limited
R22-R36 = R
SD_CARD_2 = TF: TF存储器卡槽
Y2 = XTAL: Crystal Oscillator; Published: 8-Jun-2000; LatestRevisionDate: 17-Jul-2002; LatestRevisionNote: Re-released for DXP Platform.; Publisher: Altium Limited
Y3 = XTAL_1: Crystal Oscillator; Published: 8-Jun-2000; LatestRevisionDate: 17-Jul-2002; LatestRevisionNote: Re-released for DXP Platform.; Publisher: Altium Limited

## Sheet DEVICES.SchDoc
size A4
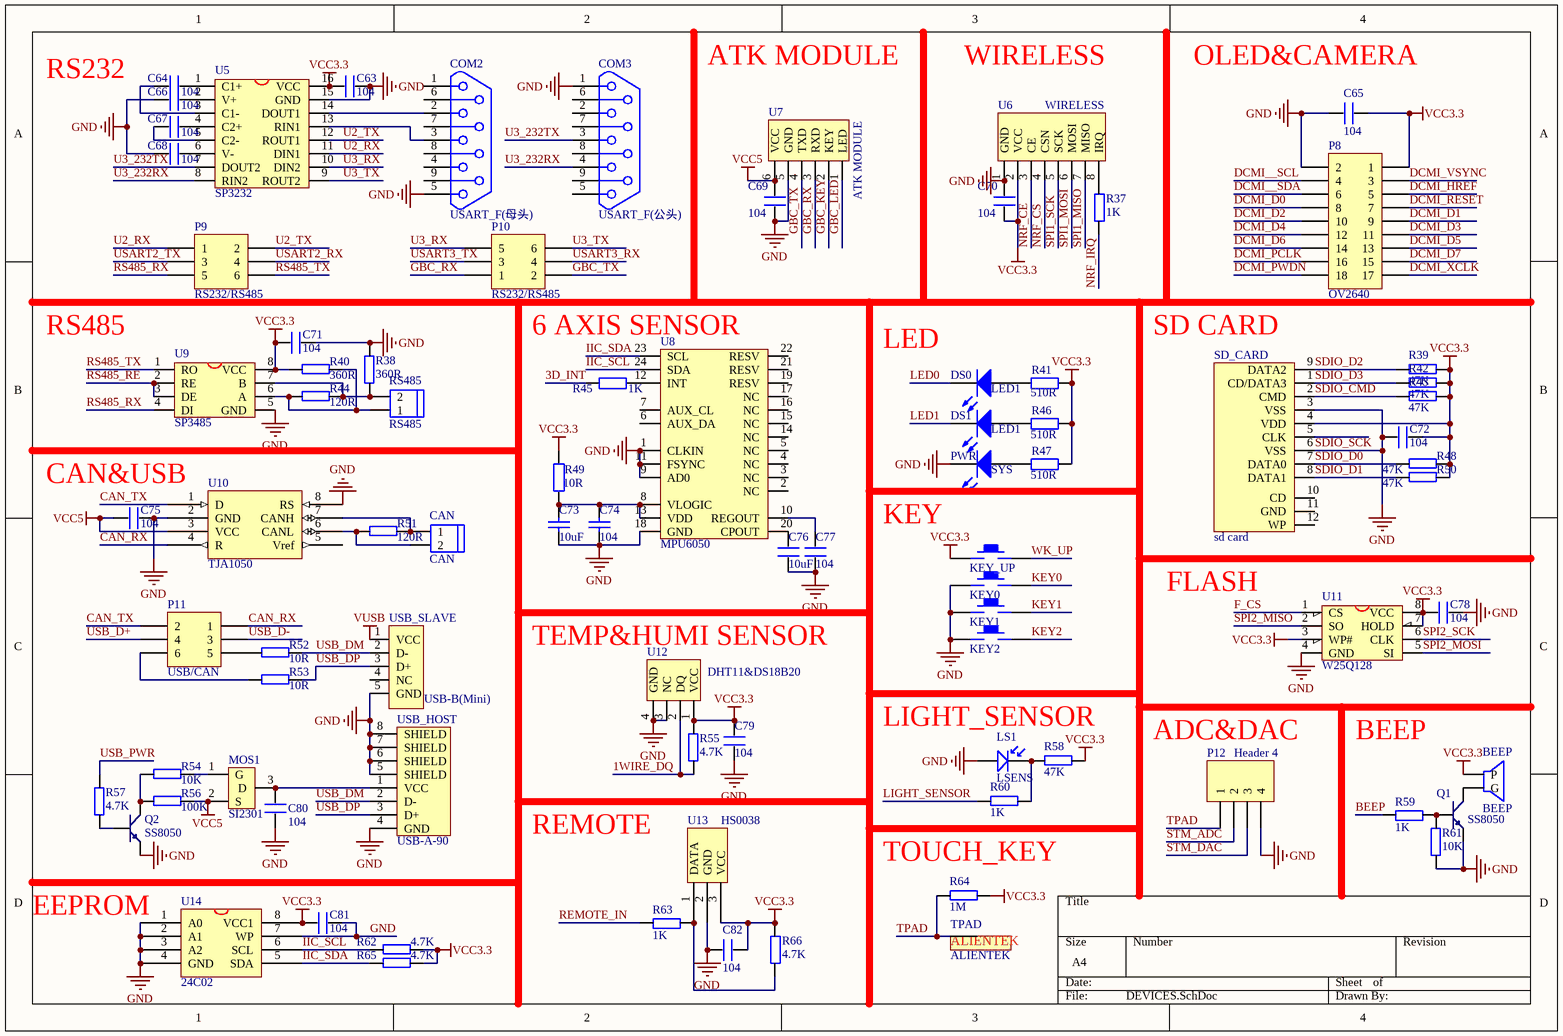
[diagram p2: DEVICES.SchDoc]

### Parts
BEEP  BEEP  [BELL-5]
C63  104  [R0603]
C64  104  [R0603]
C65  104  [R0603]
C66  104  [R0603]
C67  104  [R0603]
C68  104  [R0603]
C69  104  [R0603]
C70  104  [R0603]
C71  104  [R0603]
C72  104  [R0603]
C73  10uF  [1206]
C74  104  [R0603]
C75  104  [R0603]
C76  10uF  [1206]
C77  104  [R0603]
C78  104  [R0603]
C79  104  [R0603]
C80  104  [R0603]
C81  104  [R0603]
C82  104  [R0603]
CAN  CAN  [HEAD2L-0.8]
COM2  USART_F(母头)  [DB9]
COM3  USART_F(公头)  [DB9]
DS0  LED1  [SMDLED]
DS1  LED1  [SMDLED]
KEY0  KEY_M  [KEY_M]  (value not drawn)
KEY1  KEY_M  [KEY_M]  (value not drawn)
KEY2  KEY_M  [KEY_M]  (value not drawn)
KEY_UP  KEY_M  [KEY_M]  (value not drawn)
LS1  LSENS  [SMDLED]
MOS1  SI2301  [SO-G3/C2.5]
P8  OV2640  [HDR2X9]
P9  RS232/RS485  [HDR2X3]
P10  RS232/RS485  [HDR2X3]
P11  USB/CAN  [HDR2X3]
P12  Header 4  [HDR1X4]
PWR  SYS  [SMDLED]
Q1  SS8050  [SOT23-3]
Q2  SS8050  [SOT23-3]
R37  1K  [R0603]
R38  360R  [R0603]
R39  47K  [R0603]
R40  360R  [R0603]
R41  510R  [R0603]
R42  47K  [R0603]
R43  47K  [R0603]
R44  120R  [R0603]
R45  1K  [R0603]
R46  510R  [R0603]
R47  510R  [R0603]
R48  47K  [R0603]
R49  10R  [R0603]
R50  47K  [R0603]
R51  120R  [R0603]
R52  10R  [R0603]
R53  10R  [R0603]
R54  10K  [R0603]
R55  4.7K  [R0603]
R56  100K  [R0603]
R57  4.7K  [R0603]
R58  47K  [R0603]
R59  1K  [R0603]
R60  1K  [R0603]
R61  10K  [R0603]
R62  4.7K  [R0603]
R63  1K  [R0603]
R64  1M  [R0603]
R65  4.7K  [R0603]
R66  4.7K  [R0603]
RS485  RS485  [HEAD2L-0.8]
SD_CARD  sd card  [SDCARD_L]
TPAD  ALIENTEK  [ALIENTEK_PAD2]
U5  SP3232  [SOP16M]
U6  WIRELESS  [NRF24L01]
U7  ATK MODULE  [HEAD6]
U8  MPU6050  [QFN24]
U9  SP3485  [SOP-8]
U10  TJA1050  [SOP-8]
U11  W25Q128  [SOIC-8]
U12  DHT11&DS18B20  [DHT11]
U13  HS0038  [HS0038]
U14  24C02  [SOP-8]
USB_HOST  USB-A-90  [USB-A-90]
USB_SLAVE  USB-B(Mini)  [MiniUSB/SM0.8-6H5]

### Nets
GND: C63.2 C65.2 C66.1 C68.1 C69.1 C70.2 C71.2 C72.2 C73.1 C74.1 C75.2 C76.1 C77.1 C78.1 C79.1 C80.1 C81.1 C82.2 COM2.5 COM3.1 KEY0.2 KEY1.2 KEY2.2 LS1.1 P8.2 P12.4 PWR.2(K) Q1.2(E) Q2.2(E) R38.1 R61.2 SD_CARD.3(VSS) SD_CARD.6(VSS) U5.15(GND) U6.1(GND) U7.5(GND) U8.1(CLKIN) U8.9(AD0) U8.11(FSYNC) U8.18(GND) U9.5(GND) U10.2(GND) U10.8(RS) U11.4(GND) U12.3(NC) U12.4(GND) U13.2(GND) U14.1(A0) U14.2(A1) U14.3(A2) U14.4(GND) U14.7(WP) USB_HOST.4(GND) USB_HOST.5(SHIELD) USB_HOST.6(SHIELD) USB_HOST.7(SHIELD) USB_HOST.8(SHIELD) USB_SLAVE.5(GND)  [also labelled SDIO_SCK]
VCC3.3: BEEP.1(P) C63.1 C65.1 C70.1 C71.1 C72.1 C78.2 C79.2 C81.2 C82.1 KEY_UP.2 P8.1 R39.1 R40.2 R41.1 R42.1 R43.1 R46.1 R47.1 R48.1 R49.2 R50.1 R55.1 R58.1 R62.1 R64.1 R65.1 R66.2 SD_CARD.4(VDD) U5.16(VCC) U6.2(VCC) U9.8(VCC) U11.3(WP#) U11.7(HOLD) U11.8(VCC) U12.1(VCC) U13.3(VCC) U14.8(VCC1)
VCC5: C69.2 C75.1 MOS1.2(S) R56.1 U7.6(VCC) U10.3(VCC)
VUSB: USB_SLAVE.1(VCC)
1WIRE_DQ: P8.18 R55.2 U12.2(DQ)  [also labelled DCMI_PWDN]
3D_INT: R45.2 U7.1(LED)  [also labelled GBC_LED]
BEEP: R59.1
CAN_RX: P11.1 U10.4(R)
CAN_TX: P11.2 U10.1(D)
DCMI__SCL: P8.4
DCMI__SDA: P8.6
DCMI_D0: P8.8
DCMI_D1: P8.9
DCMI_D2: P8.10 R48.2 SD_CARD.7(DATA0)  [also labelled SDIO_D0]
DCMI_D3: P8.11 R50.2 SD_CARD.8(DATA1)  [also labelled SDIO_D1]
DCMI_D4: P8.12 R42.2 SD_CARD.1(CD/DATA3)  [also labelled SDIO_D3]
DCMI_D5: P8.13
DCMI_D6: P8.14
DCMI_D7: P8.15
DCMI_HREF: P8.5 P12.3  [also labelled STM_DAC]
DCMI_PCLK: P8.16
DCMI_RESET: P8.7
DCMI_VSYNC: P8.3
DCMI_XCLK: P8.17 R63.1  [also labelled REMOTE_IN]
F_CS: U11.1(CS)
GBC_KEY: U7.2(KEY)
GBC_RX: P10.1 U7.3(RXD)
GBC_TX: P10.2 U7.4(TXD)
IIC_SCL: R62.2 U8.24(SDA) U14.6(SCL)
IIC_SDA: R65.2 U8.23(SCL) U14.5(SDA)
KEY0: KEY0.1
KEY1: KEY1.1
KEY2: KEY2.1
LED0: DS0.2(K)
LED1: DS1.2(K)
LIGHT_SENSOR: R60.2
NRF_CE: U6.3(CE)
NRF_CS: U6.4(CSN)
NRF_IRQ: R37.1 U9.2(RE) U9.3(DE)  [also labelled RS485_RE]
RS485_RX: P9.5 U9.4(DI)
RS485_TX: P9.6 U9.1(RO)
SDIO_CMD: R43.2 SD_CARD.2(CMD)  [project net PD2]
SDIO_D2: R39.2 SD_CARD.9(DATA2)  [project net PC10]
SPI1_MISO: U6.7(MISO)  [project net JTRST]
SPI1_MOSI: U6.6(MOSI)  [project net PB5]
SPI1_SCK: U6.5(SCK)  [project net JTDO]
SPI2_MISO: U11.2(SO)
SPI2_MOSI: U11.5(SI)
SPI2_SCK: U11.6(CLK)
STM_ADC: P12.2  [project net PA5]
TPAD: P12.1 R64.2 TPAD.1
U2_RX: P9.1 U5.11(DIN1)
U2_TX: P9.2 U5.12(ROUT1)
U3_232RX: COM3.4 U5.8(RIN2)
U3_232TX: COM3.3 U5.7(DOUT2)
U3_RX: P10.5 U5.10(DIN2)
U3_TX: P10.6 U5.9(ROUT2)
USART2_RX: P9.4  [project net PA3]
USART2_TX: P9.3  [project net ETH_MDIO]
USART3_RX: P10.4  [project net PB11]
USART3_TX: P10.3  [project net PB10]
USB_D+: P11.4  [project net PA12]
USB_D-: P11.3  [project net PA11]
USB_DM: R52.1 USB_HOST.2(D-) USB_SLAVE.2(D-)
USB_DP: R53.1 USB_HOST.3(D+) USB_SLAVE.3(D+)
USB_PWR: R57.1  [project net JTDI]
WK_UP: KEY_UP.1  [project net PA0]
NetBEEP_2: BEEP.2(G) Q1.3(C)
NetC64_1: C64.1 U5.3(C1-)
NetC64_2: C64.2 U5.1(C1+)
NetC66_2: C66.2 U5.2(V+)
NetC67_1: C67.1 U5.5(C2-)
NetC67_2: C67.2 U5.4(C2+)
NetC68_2: C68.2 U5.6(V-)
NetC73_2: C73.2 C74.2 R49.1 U8.8(VLOGIC) U8.13(VDD)
NetC76_2: C76.2 U8.20(CPOUT)
NetC77_2: C77.2 U8.10(REGOUT)
NetC80_2: C80.2 MOS1.3(D) USB_HOST.1(VCC)
NetCAN_1: CAN.1 R51.1 U10.7(CANH)
NetCAN_2: CAN.2 R51.2 U10.6(CANL)
NetCOM2_2: COM2.2 U5.14(DOUT1)
NetCOM2_3: COM2.3 U5.13(RIN1)
NetDS0_1: DS0.1(A) R41.2
NetDS1_1: DS1.1(A) R46.2
NetLS1_2: LS1.2 R58.2 R60.1
NetMOS1_1: MOS1.1(G) R54.1
NetP11_5: P11.5 R52.2
NetP11_6: P11.6 R53.2
NetPWR_1: PWR.1(A) R47.2
NetQ1_1: Q1.1(B) R59.2 R61.1
NetQ2_1: Q2.1(B) R57.2
NetQ2_3: Q2.3(C) R54.2 R56.2
NetR37_2: R37.2 U6.8(IRQ)
NetR38_2: R38.2 R44.1 RS485.2 U9.7(B)
NetR40_1: R40.1 R44.2 RS485.1 U9.6(A)
NetR45_1: R45.1 U8.12(INT)
NetR63_2: R63.2 R66.1 U13.1(DATA)

Not connected (* = marked no-connect by the designer): COM2 1 4 6 7 8 9; COM3 2 5 6 7 8 9; SD_CARD 5(CLK) 10(CD) 11(GND) 12(WP); U8 2(NC) 3(NC) 4(NC) 5(NC) 6(AUX_DA) 7(AUX_CL) 14(NC) 15(NC) 16(NC) 17(NC) 19(RESV) 21(RESV) 22(RESV); U10 5(Vref); USB_SLAVE 4(NC)

### Notes on the sheet
- RS232
- ATK MODULE
- WIRELESS
- (near C65) OLED&CAMERA
- RS485
- (near U8) 6 AXIS SENSOR
- LED
- (near SD_CARD) SD CARD
- (near C75) CAN&USB
- KEY
- TEMP&HUMI SENSOR
- FLASH
- LIGHT_SENSOR
- ADC&DAC
- BEEP
- REMOTE
- EEPROM
- TOUCH_KEY

### Library data of the parts
C63-C72 C75-C82 = C
C73 C74 = Cap Semi: Capacitor (Semiconductor SIM Model); Value: 100nF
CAN RS485 = HEAD2
COM2 COM3 = DB9
DS0 DS1 PWR = LED2: Typical RED, GREEN, YELLOW, AMBER GaAs LED; Published: 8-Jun-2000; LatestRevisionDate: 17-Jul-2002; LatestRevisionNote: Re-released for DXP Platform.; PackageDocument: Feb-2002; PackageReference: 3.2X1.6X1.1; Publisher: Altium Limited
LS1 = LSENS: LIGHT SENS
MOS1 = MOS-P: IRLML6401/SI2301
P8 = Header 9X2: Header, 9-Pin, Dual row; LatestRevisionDate: 17-Jul-2002; LatestRevisionNote: Re-released for DXP Platform.; Publisher: Altium Limited
P9-P11 = Header 3X2: Header, 3-Pin, Dual row; LatestRevisionDate: 17-Jul-2002; LatestRevisionNote: Re-released for DXP Platform.; Publisher: Altium Limited
P12 = Header 4: Header, 4-Pin; LatestRevisionDate: 17-Jul-2002; LatestRevisionNote: Re-released for DXP Platform.; Publisher: Altium Limited
R37-R40 R42-R44 R48 R50-R66 = R
R41 R45-R47 R49 = Res2: Resistor; Value: 10K; Published: 8-Jun-2000; LatestRevisionDate: 17-Jul-2002; LatestRevisionNote: Re-released for DXP Platform.; PackageReference: AXIAL-0.4; Publisher: Altium Limited
TPAD = TPAD: ALIENTEK TPAD
U5 = MAX3232
U6 = NRF24L01
U7 = ATK-HC05
U8 = MPU6050: 9轴运动处理传感器
U9 = MAX3485
U10 = SN65HVD230D
U11 = W25X16: W25X16;SST25VF016;MX25L1605
U12 = DHT11: 数字温湿度传感器
U14 = 24C256
USB_HOST = USB_A_90
USB_SLAVE = USB5

## Sheet POWER&USB_USART.SchDoc
size A4
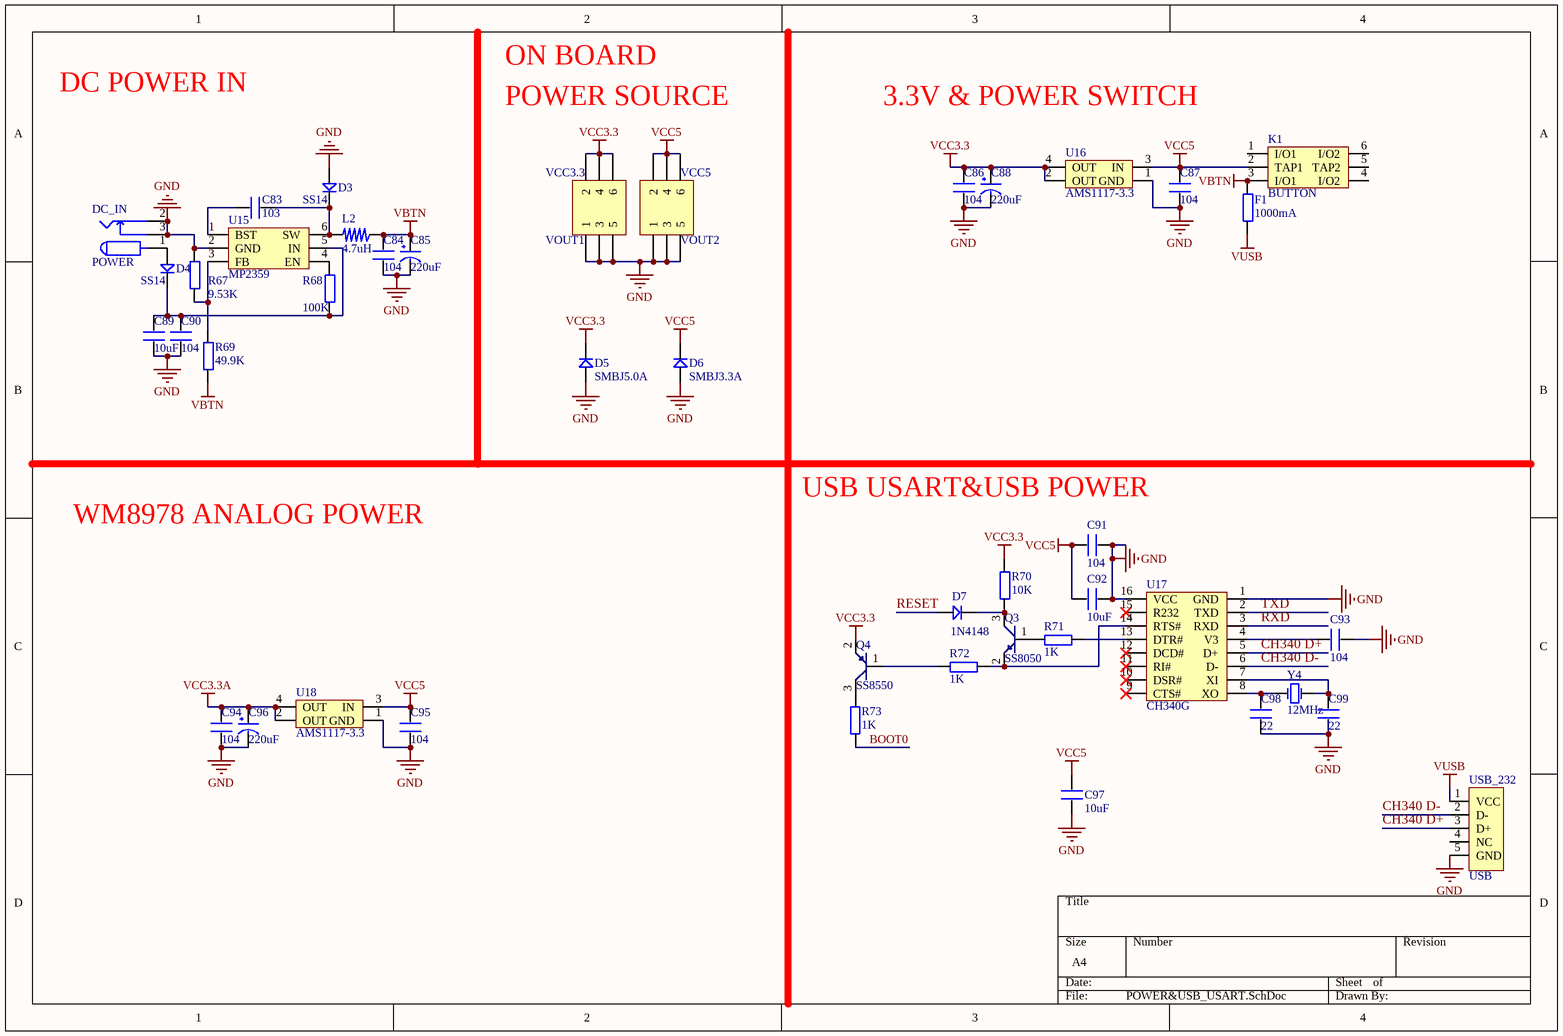
[diagram p3: POWER&USB_USART.SchDoc]

### Parts
C83  103  [R0603]
C84  104  [R0603]
C85  220uF  [CC6.56.5]
C86  104  [R0603]
C87  104  [R0603]
C88  220uF  [CC6.56.5]
C89  10uF  [1206]
C90  104  [R0603]
C91  104  [R0603]
C92  10uF  [1206]
C93  104  [R0603]
C94  104  [R0603]
C95  104  [R0603]
C96  220uF  [CC6.56.5]
C97  10uF  [1206]
C98  22  [R0603]
C99  22  [R0603]
D3  SS14  [DIODE_3*5.3]
D4  SS14  [DIODE_3*5.3]
D5  SMBJ5.0A  [SMBJ]
D6  SMBJ3.3A  [SMBJ]
D7  1N4148  [DIODE_SOP]
DC_IN  POWER  [DC10B]
F1  1000mA  [1206]
K1  BUTTON  [BTN8.5*8.5]
L2  4.7uH  [L_SOP74]
Q3  SS8050  [SOT23-3]
Q4  SS8550  [SOT23-3]
R67  9.53K  [R0603]
R68  100K  [R0603]
R69  49.9K  [R0603]
R70  10K  [R0603]
R71  1K  [R0603]
R72  1K  [R0603]
R73  1K  [R0603]
U15  MP2359  [SOT-23-6]
U16  AMS1117-3.3  [AMS1117]
U17  CH340G  [SOP16M]
U18  AMS1117-3.3  [AMS1117]
USB_232  USB  [MiniUSB/SM0.8-6H5]
VOUT1  VCC3.3  [HDR2X3]
VOUT2  VCC5  [HDR2X3]
Y4  12MHz  [XTAL_US]

### Nets
GND: C84.2 C85.2(GND) C86.2 C87.2 C88.2(GND) C89.2 C90.2 C91.1 C92.1 C93.1 C94.2 C95.2 C96.2(GND) C97.2 C98.1 C99.1 D3.1 D5.1 D6.1 DC_IN.2 DC_IN.3 R67.2 U15.2(GND) U16.1(GND) U17.1(GND) U17.16(VCC) U18.1(GND) USB_232.5(GND) VOUT1.1 VOUT1.3 VOUT1.5 VOUT2.1 VOUT2.3 VOUT2.5
VBTN: C84.1 C85.1(VCC) F1.2 K1.3(I/O1) L2.1 R69.1
VCC3.3: C86.1 C88.1(VCC) D5.2 Q4.2(E) R70.1 U16.2(OUT) U16.4(OUT) VOUT1.2 VOUT1.4 VOUT1.6
VCC3.3A: C94.1 C96.1(VCC) U18.2(OUT) U18.4(OUT)
VCC5: C87.1 C91.2 C92.2 C95.1 C97.1 D6.2 K1.2(TAP1) U16.3(IN) U18.3(IN) VOUT2.2 VOUT2.4 VOUT2.6
VUSB: F1.1 USB_232.1(VCC)
BOOT0: R73.2
CH340 D+: U17.5(D+) USB_232.3(D+)
CH340 D-: U17.6(D-) USB_232.2(D-)
RESET: D7.1
RXD: U17.3(RXD)
TXD: U17.2(TXD)
NetC83_1: C83.1 D3.2 L2.2 U15.6(SW)
NetC83_2: C83.2 U15.1(BST)
NetC89_1: C89.1 C90.1 D4.2 R68.1 U15.5(IN)
NetC93_2: C93.2 U17.4(V3)
NetC98_2: C98.2 U17.8(XO) Y4.2(OSC2)
NetC99_2: C99.2 U17.7(XI) Y4.1(OSC1)
NetD4_1: D4.1 DC_IN.1
NetD7_2: D7.2 Q3.3(C) R70.2
NetQ3_1: Q3.1(B) R71.2
NetQ3_2: Q3.2(E) R72.1 U17.14(RTS#)
NetQ4_1: Q4.1(B) R72.2
NetQ4_3: Q4.3(C) R73.1
NetR67_1: R67.1 R69.2 U15.3(FB)
NetR68_2: R68.2 U15.4(EN)
NetR71_1: R71.1 U17.13(DTR#)

Not connected (* = marked no-connect by the designer): K1 1(I/O1) 4(I/O2) 5(TAP2) 6(I/O2); U17 9(CTS#)* 10(DSR#)* 11(RI#)* 12(DCD#)* 15(R232)*; USB_232 4(NC)

### Notes on the sheet
- DC POWER IN
- ON BOARD
- POWER SOURCE
- 3.3V & POWER SWITCH
- (near C91) USB USART&USB POWER
- WM8978 ANALOG POWER

### Library data of the parts
C83 C84 C86 C87 C89-C95 C97-C99 = C
C85 C88 C96 = CAP
D3-D7 = D
DC_IN = POW
F1 R67-R73 = R
L2 = L_SOP
U15 = MP2359: DC DC Step Down IC
U16 U18 = AMS1117
U17 = CH340G: USB2UART
USB_232 = USB5
VOUT1 VOUT2 = Header 3X2: Header, 3-Pin, Dual row; LatestRevisionDate: 17-Jul-2002; LatestRevisionNote: Re-released for DXP Platform.; Publisher: Altium Limited
Y4 = XTAL_2: Crystal Oscillator; Published: 8-Jun-2000; LatestRevisionDate: 17-Jul-2002; LatestRevisionNote: Re-released for DXP Platform.; Publisher: Altium Limited

## Nets that join several sheets
GND: AUDIO&ETHNET (36 pins), CORE (63 pins), DEVICES (58 pins), POWER&USB_USART (34 pins)
VCC3.3: AUDIO&ETHNET (5 pins), CORE (16 pins), DEVICES (38 pins), POWER&USB_USART (10 pins)
VCC3.3A: AUDIO&ETHNET (C1.2 C2.2 U2.31), POWER&USB_USART (C94.1 C96.1 U18.2 U18.4)
VCC5: AUDIO&ETHNET (R1.2), CORE (C38.1 TFTLCD.28), DEVICES (6 pins), POWER&USB_USART (12 pins)
VUSB: DEVICES (USB_SLAVE.1), POWER&USB_USART (F1.1 USB_232.1)
1WIRE_DQ: CORE (P4.14 U4.124), DEVICES (P8.18 R55.2 U12.2)
3D_INT: CORE (P3.19 U4.26), DEVICES (R45.2 U7.1)
BEEP: CORE (P3.18 U4.20), DEVICES (R59.1)
BOOT0: CORE (R34.2 U4.138), POWER&USB_USART (R73.2)
DCMI__SCL: CORE (P4.16 U4.122), DEVICES (P8.4)
DCMI__SDA: CORE (P4.15 U4.123), DEVICES (P8.6)
DCMI_D0: AUDIO&ETHNET (U2.11), CORE (P4.31 U4.96), DEVICES (P8.8)
DCMI_D1: CORE (P4.30 U4.97), DEVICES (P8.9)
DCMI_D2: CORE (P4.29 SD_CARD_2.7 U4.98), DEVICES (P8.10 R48.2 SD_CARD.7)
DCMI_D3: CORE (P4.28 SD_CARD_2.8 U4.99), DEVICES (P8.11 R50.2 SD_CARD.8)
DCMI_D4: CORE (P4.22 SD_CARD_2.2 U4.112), DEVICES (P8.12 R42.2 SD_CARD.1)
DCMI_D5: CORE (P4.4 U4.136), DEVICES (P8.13)
DCMI_D6: CORE (P3.5 U4.4), DEVICES (P8.14)
DCMI_D7: CORE (P3.8 U4.5), DEVICES (P8.15)
DCMI_HREF: CORE (P3.25 U4.40), DEVICES (P8.5 P12.3)
DCMI_PCLK: CORE (P3.27 U4.42), DEVICES (P8.16)
DCMI_RESET: CORE (P4.8 U4.132), DEVICES (P8.7)
DCMI_VSYNC: CORE (P4.3 U4.137), DEVICES (P8.3)
DCMI_XCLK: CORE (P4.27 U4.100), DEVICES (P8.17 R63.1)
ETH_MDC: AUDIO&ETHNET (U1.13), CORE (P3.22 U4.27)
ETH_MDIO: AUDIO&ETHNET (R2.1), CORE (U4.36), DEVICES (P9.3)
ETH_RESET: AUDIO&ETHNET (R10.2 U1.15), CORE (P4.19 U4.117)
F_CS: CORE (P4.43 U4.75), DEVICES (U11.1)
GBC_KEY: CORE (P3.16 U4.18), DEVICES (U7.2)
I2S_LRCK: AUDIO&ETHNET (U2.7), CORE (P3.44 U4.73)
I2S_SCLK: AUDIO&ETHNET (U2.8), CORE (P3.41 U4.74)
I2S_SDIN: AUDIO&ETHNET (U2.10), CORE (P3.24 U4.29)
I2S_SDOUT: AUDIO&ETHNET (U2.9), CORE (P3.21 U4.28)
IIC_SCL: AUDIO&ETHNET (U2.16), CORE (P4.2 U4.139), DEVICES (R62.2 U8.24 U14.6)
IIC_SDA: AUDIO&ETHNET (U2.17), CORE (P4.1 U4.140), DEVICES (R65.2 U8.23 U14.5)
JTDI: CORE (JTAG.5 P4.24 R29.2 U4.110), DEVICES (R57.1)
JTDO: CORE (JTAG.13 P4.7 R33.2 U4.133), DEVICES (U6.5)
JTRST: CORE (JTAG.3 P4.6 R28.2 U4.134), DEVICES (U6.7)
KEY0: CORE (P3.6 U4.3), DEVICES (KEY0.1)
KEY1: CORE (P3.3 U4.2), DEVICES (KEY1.1)
KEY2: CORE (P3.4 U4.1), DEVICES (KEY2.1)
LED0: CORE (P3.17 U4.21), DEVICES (DS0.2)
LED1: CORE (P3.20 U4.22), DEVICES (DS1.2)
LIGHT_SENSOR: CORE (P3.15 U4.19), DEVICES (R60.2)
NRF_CE: CORE (P4.34 U4.91), DEVICES (U6.3)
NRF_CS: CORE (P4.33 U4.92), DEVICES (U6.4)
NRF_IRQ: CORE (P4.32 U4.93), DEVICES (R37.1 U9.2 U9.3)
PA0: CORE (P3.26 U4.34), DEVICES (KEY_UP.1)
PA1: AUDIO&ETHNET (U1.14), CORE (P3.23 U4.35)
PA3: AUDIO&ETHNET (R20.2), CORE (U4.37), DEVICES (P9.4)
PA5: CORE (P3.28 U4.41), DEVICES (P12.2)
PA7: AUDIO&ETHNET (U1.11), CORE (P3.30 U4.43)
PA11: CORE (U4.103), DEVICES (P11.3)
PA12: CORE (U4.104), DEVICES (P11.4)
PB5: CORE (P4.5 U4.135), DEVICES (U6.6)
PB10: CORE (U4.69), DEVICES (P10.3)
PB11: CORE (U4.70), DEVICES (P10.4)
PC4: AUDIO&ETHNET (U1.8), CORE (P3.29 U4.44)
PC5: AUDIO&ETHNET (U1.7), CORE (P3.32 U4.45)
PC10: CORE (P4.23 SD_CARD_2.1 U4.111), DEVICES (R39.2 SD_CARD.9)
PD2: CORE (P4.20 SD_CARD_2.3 U4.116), DEVICES (R43.2 SD_CARD.2)
PG11: AUDIO&ETHNET (U1.16), CORE (P4.12 U4.126)
PG13: AUDIO&ETHNET (U1.17), CORE (P4.10 U4.128)
PG14: AUDIO&ETHNET (U1.18), CORE (P4.9 U4.129)
RESET: CORE (6 pins), POWER&USB_USART (D7.1)
RXD: CORE (P6.4), POWER&USB_USART (U17.3)
TXD: CORE (P6.2), POWER&USB_USART (U17.2)